# EAGLE design sumo_base_5 (EAGLE 6.3)
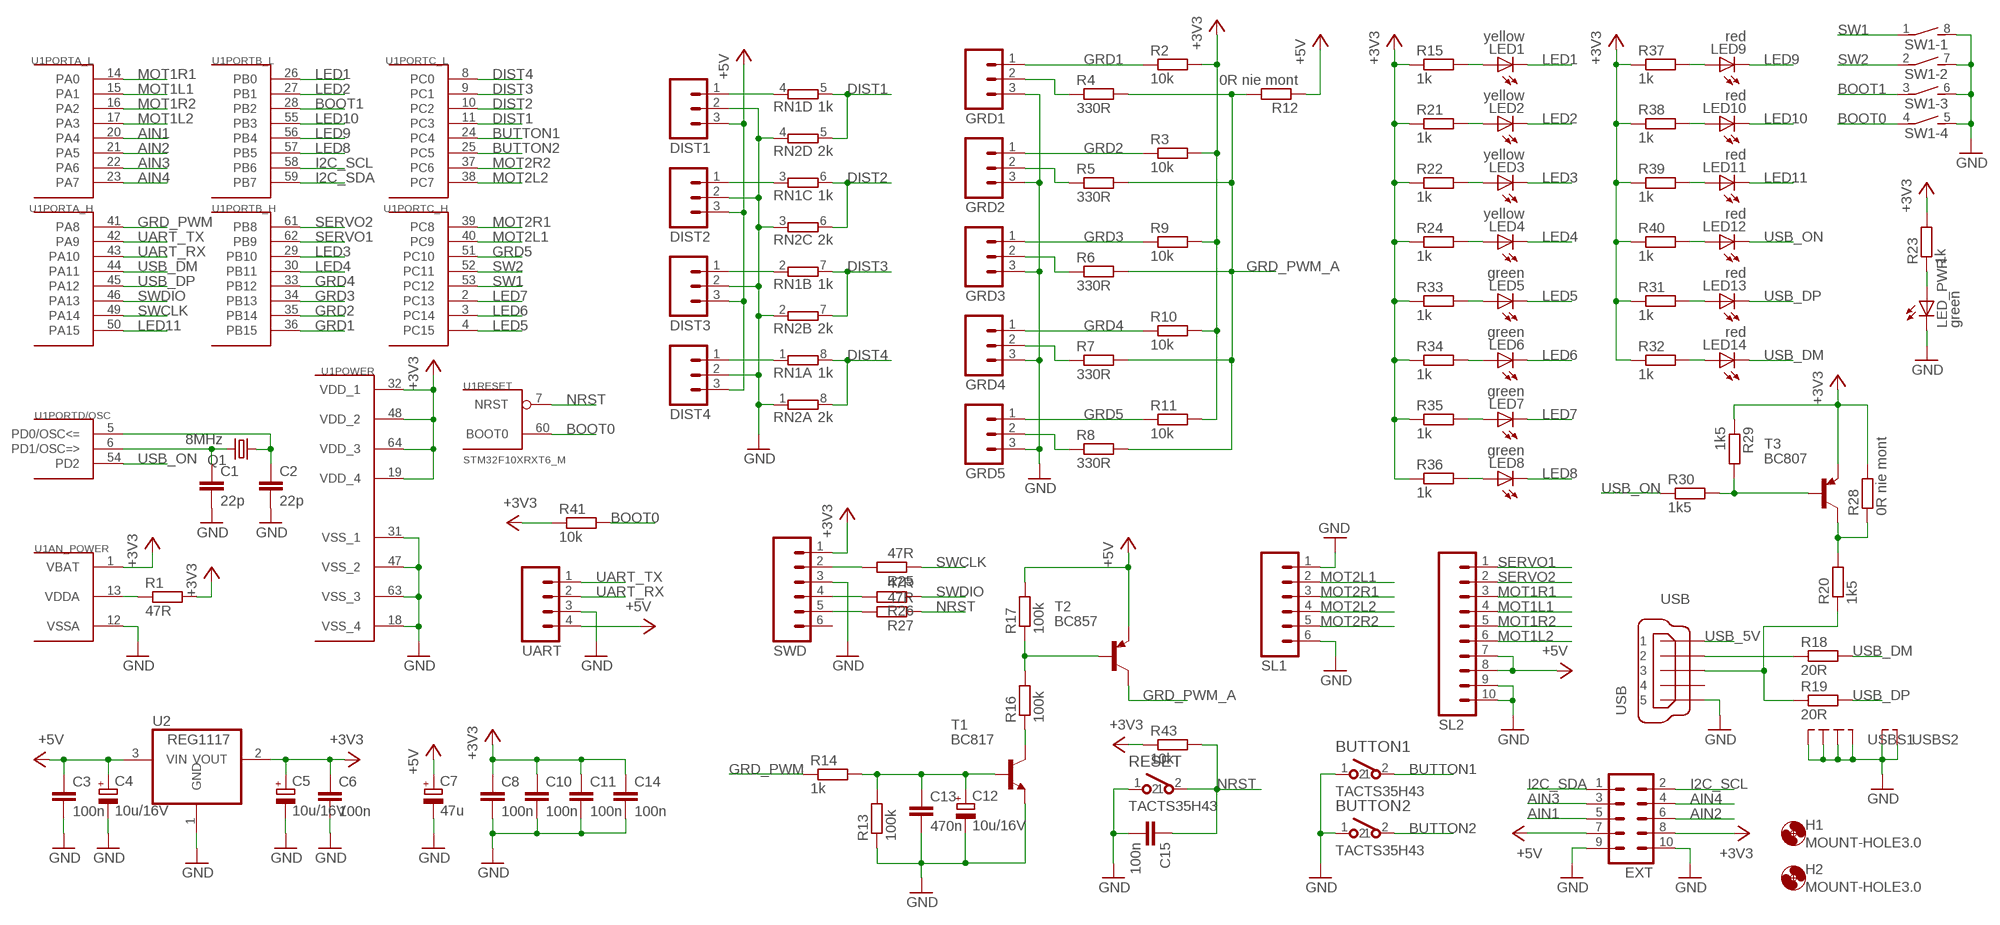
[diagram p0: schematic, sheet 1]

## Parts
BUTTON1  TACTS35H43  [TACTS35H43]
BUTTON2  TACTS35H43  [TACTS35H43]
C1  22p  C-EUC0603  [C0603]
C2  22p  C-EUC0603  [C0603]
C3  100n  C-EUC0603  [C0603]
C4  10u/16V  CPOL-EUSMCA  [SMC_A]
C5  10u/16V  CPOL-EUSMCA  [SMC_A]
C6  100n  C-EUC0603  [C0603]
C7  47u  CPOL-EUSMCB  [SMC_B]
C8  100n  C-EUC0603  [C0603]
C10  100n  C-EUC0603  [C0603]
C11  100n  C-EUC0603  [C0603]
C12  10u/16V  CPOL-EUSMCA  [SMC_A]
C13  470n  C-EUC0603  [C0603]
C14  100n  C-EUC0603  [C0603]
C15  100n  C-EUC0603  [C0603]
DIST1  M03  [03P]
DIST2  M03  [03P]
DIST3  M03  [03P]
DIST4  M03  [03P]
EXT  MA05-2  [MA05-2]
GRD1  M03  [03P]
GRD2  M03  [03P]
GRD3  M03  [03P]
GRD4  M03  [03P]
GRD5  M03  [03P]
H1  MOUNT-HOLE3.0  [3,0]
H2  MOUNT-HOLE3.0  [3,0]
LED1  yellow  LEDSML0805  [SML0805]
LED2  yellow  LEDSML0805  [SML0805]
LED3  yellow  LEDSML0805  [SML0805]
LED4  yellow  LEDSML0805  [SML0805]
LED5  green  LEDSML0805  [SML0805]
LED6  green  LEDSML0805  [SML0805]
LED7  green  LEDSML0805  [SML0805]
LED8  green  LEDSML0805  [SML0805]
LED9  red  LEDSML0805  [SML0805]
LED10  red  LEDSML0805  [SML0805]
LED11  red  LEDSML0805  [SML0805]
LED12  red  LEDSML0805  [SML0805]
LED13  red  LEDSML0805  [SML0805]
LED14  red  LEDSML0805  [SML0805]
LED_PWR  green  LEDSML0805  [SML0805]
Q1  8MHz  CRYSTALHC49S  [HC49/S]
R1  47R  R-EU_R0603  [R0603]
R2  10k  R-EU_R0603  [R0603]
R3  10k  R-EU_R0603  [R0603]
R4  330R  R-EU_R0603  [R0603]
R5  330R  R-EU_R0603  [R0603]
R6  330R  R-EU_R0603  [R0603]
R7  330R  R-EU_R0603  [R0603]
R8  330R  R-EU_R0603  [R0603]
R9  10k  R-EU_R0603  [R0603]
R10  10k  R-EU_R0603  [R0603]
R11  10k  R-EU_R0603  [R0603]
R12  0R nie mont  R-EU_R0603  [R0603]
R13  100k  R-EU_R0603  [R0603]
R14  1k  R-EU_R0603  [R0603]
R15  1k  R-EU_R0603  [R0603]
R16  100k  R-EU_R0603  [R0603]
R17  100k  R-EU_R0603  [R0603]
R18  20R  R-EU_R0603  [R0603]
R19  20R  R-EU_R0603  [R0603]
R20  1k5  R-EU_R0603  [R0603]
R21  1k  R-EU_R0603  [R0603]
R22  1k  R-EU_R0603  [R0603]
R23  1k  R-EU_R0603  [R0603]
R24  1k  R-EU_R0603  [R0603]
R25  47R  R-EU_R0603  [R0603]
R26  47R  R-EU_R0603  [R0603]
R27  47R  R-EU_R0603  [R0603]
R28  0R nie mont  R-EU_R0603  [R0603]
R29  1k5  R-EU_R0603  [R0603]
R30  1k5  R-EU_R0603  [R0603]
R31  1k  R-EU_R0603  [R0603]
R32  1k  R-EU_R0603  [R0603]
R33  1k  R-EU_R0603  [R0603]
R34  1k  R-EU_R0603  [R0603]
R35  1k  R-EU_R0603  [R0603]
R36  1k  R-EU_R0603  [R0603]
R37  1k  R-EU_R0603  [R0603]
R38  1k  R-EU_R0603  [R0603]
R39  1k  R-EU_R0603  [R0603]
R40  1k  R-EU_R0603  [R0603]
R41  10k  R-EU_R0603  [R0603]
R43  10k  R-EU_R0603  [R0603]
RESET  TACTS35H43  [TACTS35H43]
RN1  1k  CAT16XXXJ4CAT16  [CAT16XXX]
RN2  2k  CAT16XXXJ4CAT16  [CAT16XXX]
SL1  M06  [06P]
SL2  M10  [10P]
SW1  DIP04S  [DIP04S]
SWD  M06  [06P]
T1  BC817  BC817-NPN-SOT23-BEC  [SOT23-BEC]
T2  BC857  BC857C-PNP-SOT23-BEC  [SOT23-BEC]
T3  BC807  BC807-16-PNP-SOT23-BEC  [SOT23-BEC]
U1  STM32F10XRXT6_M  [FP64E]
U2  REG1117  [SOT223]
UART  M04  [04P]
USB  USB  MICRO-USB_5P4S  [MX47346]

## Nets
+3V3: C5.+ C6.1 C8.1 C10.1 C11.1 C14.1 EXT.8 R1.2 R2.2 R3.2 R9.2 R10.2 R11.2 R15.1 R21.1 R22.1 R23.2 R24.1 R28.2 R29.1 R31.1 R32.1 R33.1 R34.1 R35.1 R36.1 R37.1 R38.1 R39.1 R40.1 R41.1 R43.1 SWD.1 T3.E U1.1(AN_POWER:VBAT) U1.19(POWER:VDD_4) U1.32(POWER:VDD_1) U1.48(POWER:VDD_2) U1.64(POWER:VDD_3) U2.2(VOUT)
+5V: C3.1 C4.+ C7.+ DIST1.3 DIST2.3 DIST3.3 DIST4.3 EXT.7 R12.1 R17.2 SL2.7 SL2.8 T2.E U2.3(VIN) UART.4
AIN1: EXT.5 U1.20(PORTA_L:PA4)
AIN2: EXT.6 U1.21(PORTA_L:PA5)
AIN3: EXT.3 U1.22(PORTA_L:PA6)
AIN4: EXT.4 U1.23(PORTA_L:PA7)
BOOT0: R41.2 SW1.4 U1.60(RESET:BOOT0)
BOOT1: SW1.3 U1.28(PORTB_L:PB2)
BUTTON1: BUTTON1.2 U1.24(PORTC_L:PC4)
BUTTON2: BUTTON2.2 U1.25(PORTC_L:PC5)
DIST1: RN1.5 RN2.5 U1.11(PORTC_L:PC3)
DIST2: RN1.6 RN2.6 U1.10(PORTC_L:PC2)
DIST3: RN1.7 RN2.7 U1.9(PORTC_L:PC1)
DIST4: RN1.8 RN2.8 U1.8(PORTC_L:PC0)
GND: BUTTON1.1 BUTTON2.1 C1.2 C2.2 C3.2 C4.- C5.- C6.2 C7.- C8.2 C10.2 C11.2 C12.- C13.2 C14.2 C15.2 DIST1.2 DIST2.2 DIST3.2 DIST4.2 EXT.9 EXT.10 GRD1.3 GRD2.3 GRD3.3 GRD4.3 GRD5.3 LED_PWR.C R13.1 RESET.1 RN2.1 RN2.2 RN2.3 RN2.4 SL1.1 SL1.6 SL2.9 SL2.10 SW1.5 SW1.6 SW1.7 SW1.8 SWD.3 T1.E U1.12(AN_POWER:VSSA) U1.18(POWER:VSS_4) U1.31(POWER:VSS_1) U1.47(POWER:VSS_2) U1.63(POWER:VSS_3) U2.1(GND) UART.3 USB.5 USB.M1(S1) USB.M2(S2) USB.M3(S3) USB.M4(S4) USB.M5(S1) USB.M6(S2)
GRD1: GRD1.1 R2.1 U1.36(PORTB_H:PB15)
GRD2: GRD2.1 R3.1 U1.35(PORTB_H:PB14)
GRD3: GRD3.1 R9.1 U1.34(PORTB_H:PB13)
GRD4: GRD4.1 R10.1 U1.33(PORTB_H:PB12)
GRD5: GRD5.1 R11.1 U1.51(PORTC_H:PC10)
GRD_PWM: R14.1 U1.41(PORTA_H:PA8)
GRD_PWM_A: R4.2 R5.2 R6.2 R7.2 R8.2 R12.2 T2.C
I2C_SCL: EXT.2 U1.58(PORTB_L:PB6)
I2C_SDA: EXT.1 U1.59(PORTB_L:PB7)
LED1: LED1.C U1.26(PORTB_L:PB0)
LED2: LED2.C U1.27(PORTB_L:PB1)
LED3: LED3.C U1.29(PORTB_H:PB10)
LED4: LED4.C U1.30(PORTB_H:PB11)
LED5: LED5.C U1.4(PORTC_H:PC15)
LED6: LED6.C U1.3(PORTC_H:PC14)
LED7: LED7.C U1.2(PORTC_H:PC13)
LED8: LED8.C U1.57(PORTB_L:PB5)
LED9: LED9.C U1.56(PORTB_L:PB4)
LED10: LED10.C U1.55(PORTB_L:PB3)
LED11: LED11.C U1.50(PORTA_H:PA15)
MOT1L1: SL2.4 U1.15(PORTA_L:PA1)
MOT1L2: SL2.6 U1.17(PORTA_L:PA3)
MOT1R1: SL2.3 U1.14(PORTA_L:PA0)
MOT1R2: SL2.5 U1.16(PORTA_L:PA2)
MOT2L1: SL1.2 U1.40(PORTC_H:PC9)
MOT2L2: SL1.4 U1.38(PORTC_L:PC7)
MOT2R1: SL1.3 U1.39(PORTC_H:PC8)
MOT2R2: SL1.5 U1.37(PORTC_L:PC6)
N$1: R29.2 R30.2 T3.B
N$2: R20.2 R28.1 T3.C
N$3: LED_PWR.A R23.1
N$4: LED12.A R40.2
N$8: LED13.A R31.2
N$9: LED14.A R32.2
N$12: R25.2 SWD.2
N$49: C2.1 Q1.1 U1.5(PORTD/OSC:PD0/OSC<=)
N$50: C1.1 Q1.2 U1.6(PORTD/OSC:PD1/OSC=>)
N$52: R1.1 U1.13(AN_POWER:VDDA)
N$53: DIST1.1 RN1.4
N$54: GRD3.2 R6.1
N$55: DIST3.1 RN1.2
N$56: DIST2.1 RN1.3
N$57: DIST4.1 RN1.1
N$58: GRD1.2 R4.1
N$59: GRD2.2 R5.1
N$60: GRD4.2 R7.1
N$61: GRD5.2 R8.1
N$63: C12.+ C13.1 R13.2 R14.2 T1.B
N$64: LED1.A R15.2
N$65: LED2.A R21.2
N$66: LED3.A R22.2
N$67: LED4.A R24.2
N$68: LED5.A R33.2
N$69: LED6.A R34.2
N$70: LED7.A R35.2
N$71: LED8.A R36.2
N$72: R16.1 T1.C
N$73: R16.2 R17.1 T2.B
N$74: R18.1 USB.2
N$75: R19.1 R20.1 USB.3
N$80: LED9.A R37.2
N$81: LED10.A R38.2
N$82: LED11.A R39.2
N$90: R26.2 SWD.4
N$91: R27.2 SWD.5
NRST: C15.1 R27.1 R43.2 RESET.2 U1.7(RESET:NRST)
SERVO1: SL2.1 U1.62(PORTB_H:PB9)
SERVO2: SL2.2 U1.61(PORTB_H:PB8)
SW1: SW1.1 U1.53(PORTC_H:PC12)
SW2: SW1.2 U1.52(PORTC_H:PC11)
SWCLK: R25.1 U1.49(PORTA_H:PA14)
SWDIO: R26.1 U1.46(PORTA_H:PA13)
UART_RX: U1.43(PORTA_H:PA10) UART.2
UART_TX: U1.42(PORTA_H:PA9) UART.1
USB_5V: USB.1
USB_DM: LED14.C R18.2 U1.44(PORTA_H:PA11)
USB_DP: LED13.C R19.2 U1.45(PORTA_H:PA12)
USB_ON: LED12.C R30.1 U1.54(PORTD/OSC:PD2)
Unconnected: SWD.6 USB.4

## Library data of the parts
BUTTON1 BUTTON2 RESET = sw:TACTS35H43
C1-C3 C6 C8 C10 C11 C13-C15 = rcl:C-EU: CAPACITOR, European symbol
C4 C5 C7 C12 = rcl:CPOL-EU: POLARIZED CAPACITOR, European symbol
DIST1-DIST4 GRD1-GRD5 = con-amp-quick:M03: AMP QUICK CONNECTOR; OC_FARNELL: unknown; OC_NEWARK: unknown
EXT = con-lstb:MA05-2: PIN HEADER; OC_FARNELL: unknown; OC_NEWARK: unknown
H1 H2 = holes:MOUNT-HOLE: MOUNTING HOLE with drill center marker
LED1-LED14 LED_PWR = led:LED: LED OSRAM: - CHIPLED LG R971, LG N971, LY N971, LG Q971, LY Q971, LO R971, LY R971 LH N974, LH R974 LS Q976, LO Q976, LY Q976 LO Q996 - Hyper CHIPLED LW Q18S LB Q993, LB Q99A, LB R99A - SideLED LS A670, LO A670, LY A670, LG A670, LP A670 LB A673, LV A673, LT A673, LW A673 LH A674 LY A675 LS A676, LA A676, LO A676, LY A676, LW A676 LS A679, LY A679, LG A679 - Hyper Micro SIDELED® LS Y876, LA Y876, LO Y876, LY Y876 LT Y87S - SmartLED LW L88C, LW L88S LB L89C, LB L89S, LG L890 LS L89K, LO L89K, LY L89K LS L896, LA L896, LO L896, LY L896 - TOPLED LS T670, LO T670, LY T670, LG T670, LP T670 LSG T670, LSP T670, LSY T670, LOP T670, LYG T670 LG T671, LOG T671, LSG T671 LB T673, LV T673, LT T673, LW T673 LH T674 LS T676, LA T676, LO T676, LY T676, LB T676, LH T676, LSB T676, LW T676 LB T67C, LV T67C, LT T67C, LS T67K, LO T67K, LY T67K, LW E67C LS E67B, LA E67B, LO E67B, LY E67B, LB E67C, LV E67C, LT E67C LW T67C LS T679, LY T679, LG T679 LS T770, LO T770, LY T770, LG T770, LP T770 LB T773, LV T773, LT T773, LW T773 LH T774 LS E675, LA E675, LY E675, LS T675 LS T776, LA T776, LO T776, LY T776, LB T776 LHGB T686 LT T68C, LB T68C - Hyper Mini TOPLED® LB M676 - Mini TOPLED Santana® LG M470 LS M47K, LO M47K, LY M47K Source: http://www.osram.convergy.de LUXEON: - LUMILED® LXK2-PW12-R00, LXK2-PW12-S00, LXK2-PW14-U00, LXK2-PW14-V00 LXK2-PM12-R00, LXK2-PM12-S00, LXK2-PM14-U00 LXK2-PE12-Q00, LXK2-PE12-R00, LXK2-PE12-S00, LXK2-PE14-T00, LXK2-PE14-U00 LXK2-PB12-K00, LXK2-PB12-L00, LXK2-PB12-M00, LXK2-PB14-N00, LXK2-PB14-P00, LXK2-PB14-Q00 LXK2-PR12-L00, LXK2-PR12-M00, LXK2-PR14-Q00, LXK2-PR14-R00 LXK2-PD12-Q00, LXK2-PD12-R00, LXK2-PD12-S00 LXK2-PH12-R00, LXK2-PH12-S00 LXK2-PL12-P00, LXK2-PL12-Q00, LXK2-PL12-R00 Source: www.luxeon.com KINGBRIGHT: KA-3528ASYC Source: www.kingbright.com
Q1 = crystal:CRYSTAL: CRYSTAL; OC_FARNELL: 1667008; OC_NEWARK: unknown
R1-R41 R43 = rcl:R-EU_: RESISTOR, European symbol
RN1 RN2 = ff:CAT16XXXJ4
SL1 SWD = con-amp-quick:M06: AMP QUICK CONNECTOR; OC_FARNELL: unknown; OC_NEWARK: unknown
SL2 = con-amp-quick:M10: AMP QUICK CONNECTOR; OC_FARNELL: unknown; OC_NEWARK: unknown
SW1 = switch-dil:DIP04S: DIL/CODE SWITCH; OC_FARNELL: unknown; OC_NEWARK: unknown
T1 = transistor:*-NPN-: NPN Transistror BF959 corrected 2008.03.06
T2 T3 = transistor:*-PNP-: PNP Transistror
U1 = stm32_ff:STM32F10XRXT6: STM32F101/103 64pin LQFP
U2 = burr-brown:REG1117: 800mA and 1A Low Dropout (LDO) Positive Regulator 1.8V, 2.5V, 2.85V, 3.3V, 5V, and Adj; MPN: REG1117; OC_FARNELL: 1097566; OC_NEWARK: 14P6981
UART = con-amp-quick:M04: AMP QUICK CONNECTOR; OC_FARNELL: unknown; OC_NEWARK: unknown
USB = ff:MICRO-USB_5P4S

## Board
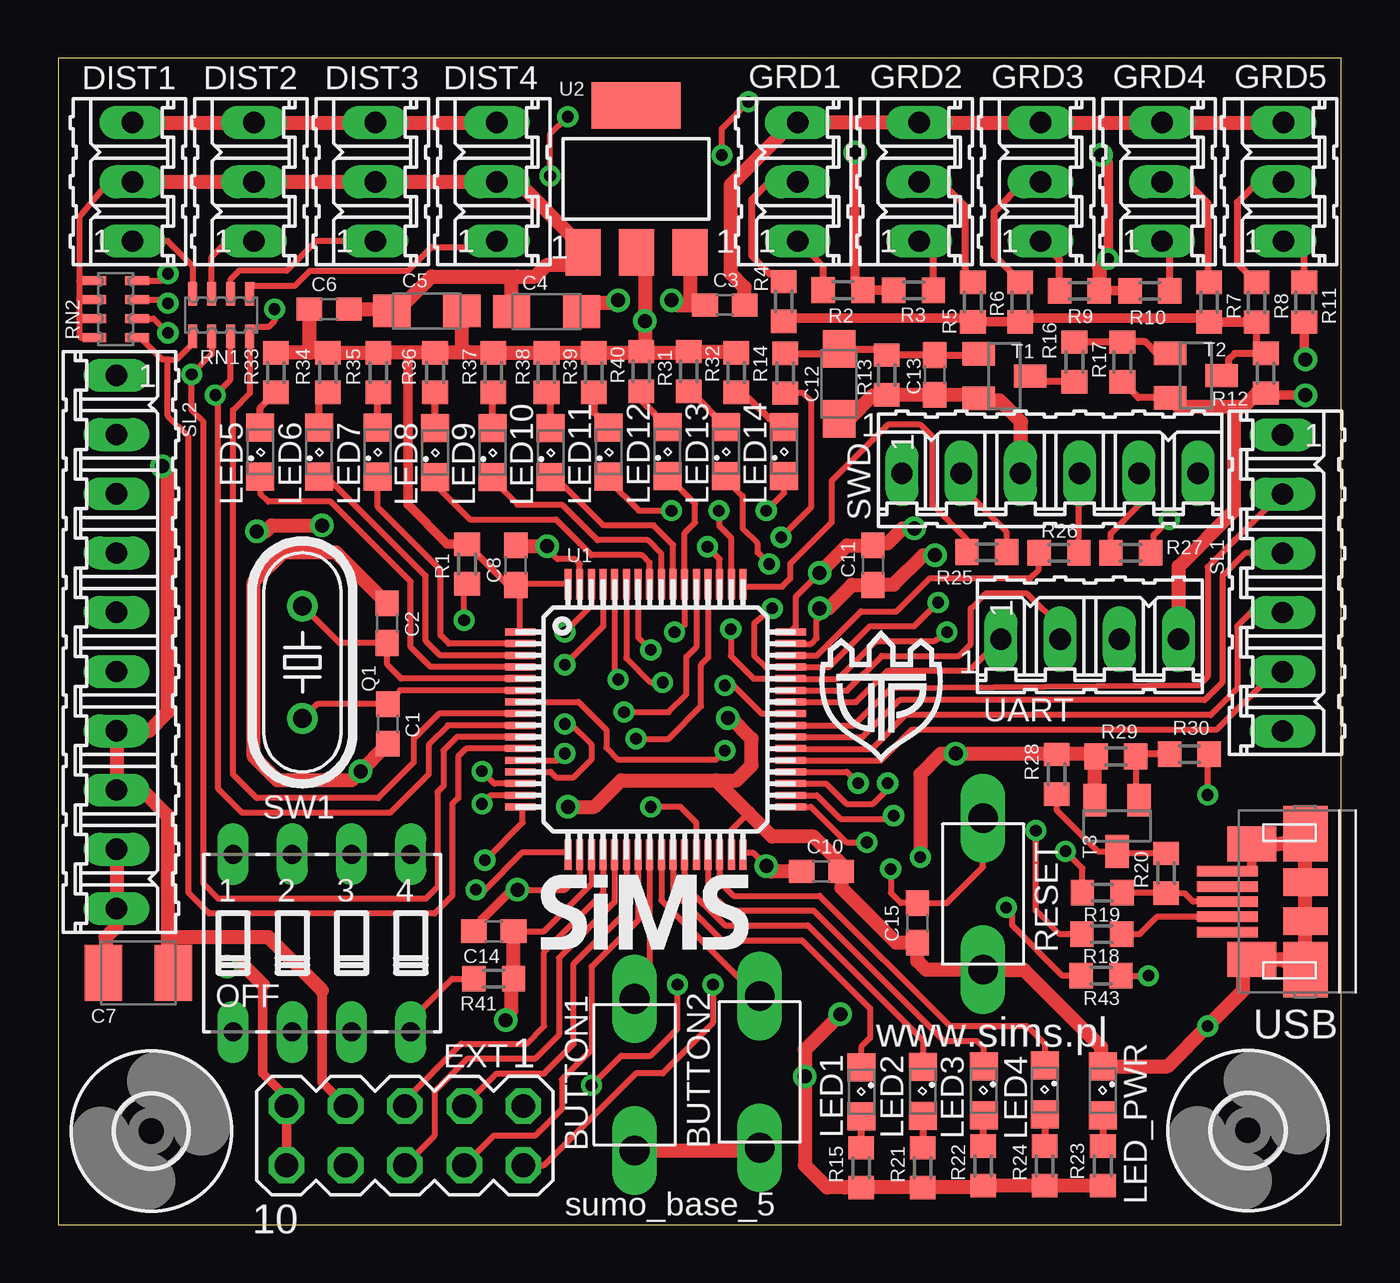
[diagram p1: board, top side]
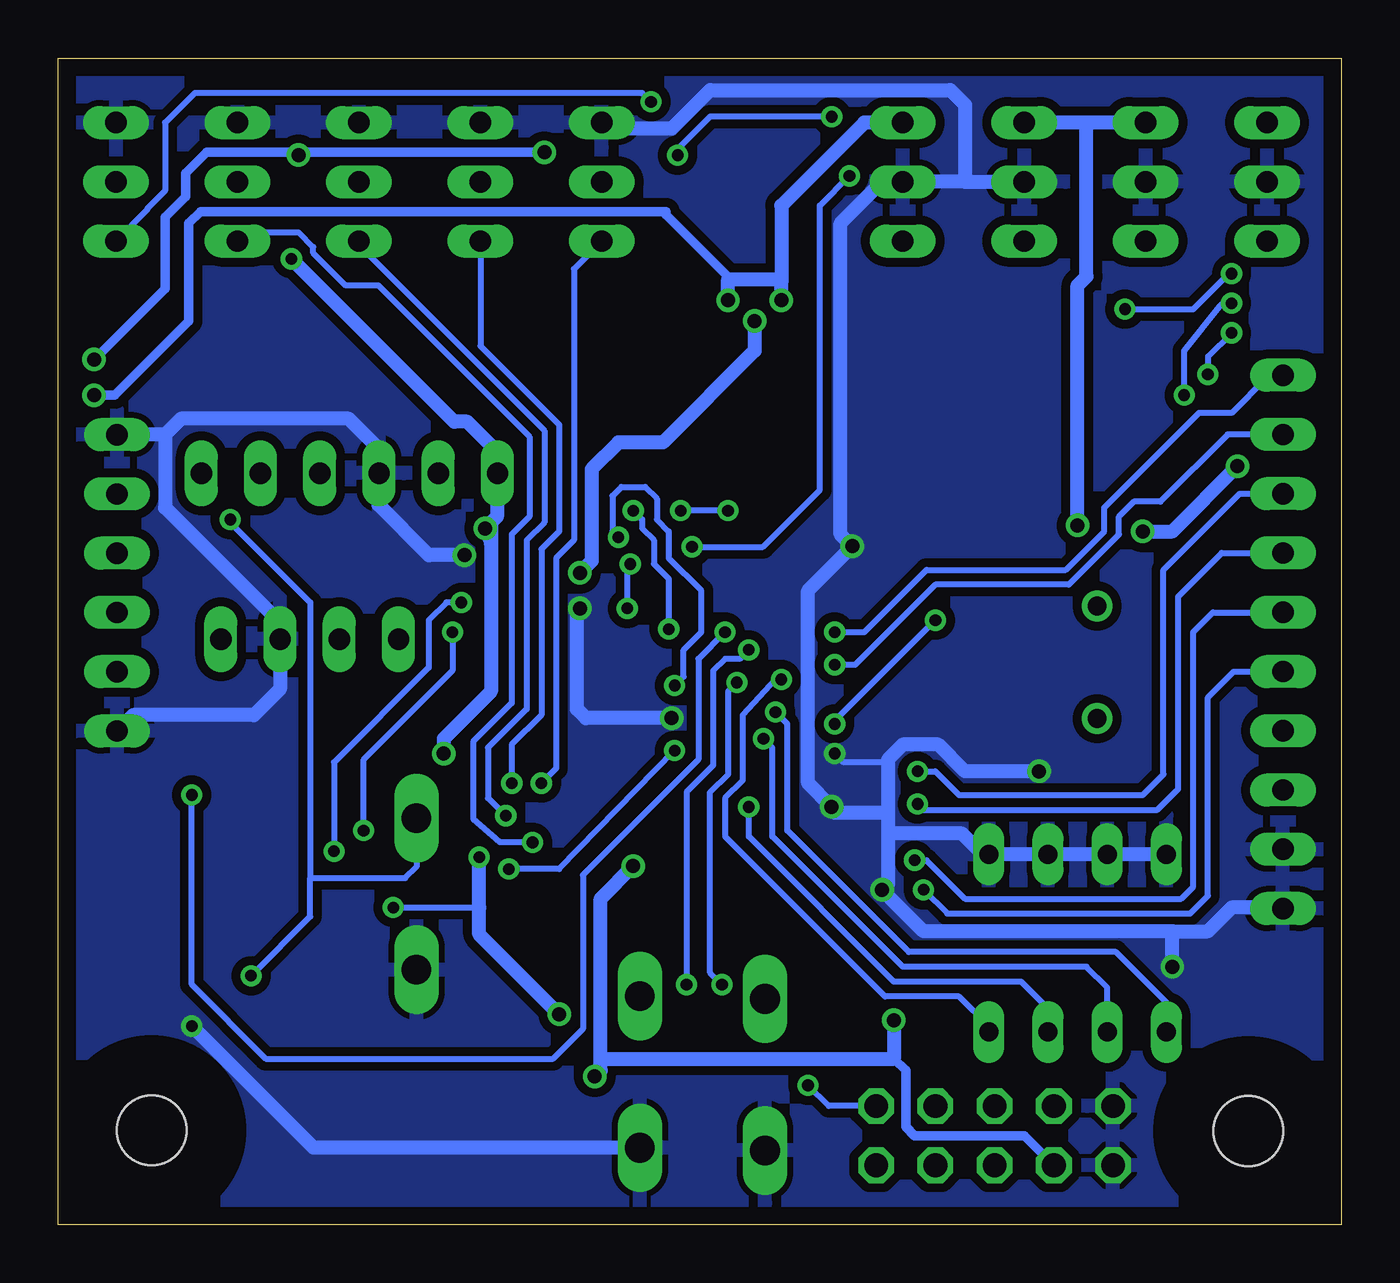
[diagram p2: board, bottom side, seen from below]

Size 55 x 50 mm. Coordinates in mm from the lower left corner, seen from the top.
Outline: 0,0 55,0 55,50 0,50 0,0
Copper layers (1*16): Top 0.035mm / dielectric 1.5mm / Bottom 0.035mm
Design rules "default *": minimum track width 10mil, minimum drill 19mil, track to track 15mil, track to pad 15mil, pad to pad 7mil, via to via 8mil, smd to smd 7mil, copper to edge 30mil, drill to drill 8mil, minimum pad ring 10mil, minimum via ring 8mil, stop-mask expansion 4mil, vias tented up to drill 100mil, thermal gap 10mil

### Footprints (pad centres in the part's own frame; a part is rotated, then mirrored left to right if it is on the bottom)
TACTS35H43 = drill 1.27 long: 1 -3.25,0; 2 3.25,0
C0603 = smd 1.1 x 1: 1 -0.85,0; 2 0.85,0
SMC_A = smd 1.6 x 1.4: + -1.5,0; - 1.5,0
SMC_B = smd 1.6 x 2.4: + -1.5,0; - 1.5,0
03P = drill 0.914 long: 1 -2.54,0; 2 0,0; 3 2.54,0
MA05-2 = drill 1.016 octagon: 1 -5.08,-1.27; 2 -5.08,1.27; 3 -2.54,-1.27; 4 -2.54,1.27; 5 0,-1.27; 6 0,1.27; 7 2.54,-1.27; 8 2.54,1.27; 9 5.08,-1.27; 10 5.08,1.27
3,0 = hole 3: 0,0
SML0805 = smd 1.2 x 1.2: A 1.05,0; C -1.05,0
HC49/S = drill 0.813: 1 -2.413,0; 2 2.413,0
R0603 = smd 1 x 1.1: 1 -0.85,0; 2 0.85,0
CAT16XXX = smd 0.381 x 1.016: 1 -1.219,-0.914; 2 -0.406,-0.914; 3 0.406,-0.914; 4 1.219,-0.914; 5 1.219,0.914; 6 0.406,0.914; 7 -0.406,0.914; 8 -1.219,0.914
06P = drill 0.914 long: 1 -6.35,0; 2 -3.81,0; 3 -1.27,0; 4 1.27,0; 5 3.81,0; 6 6.35,0
10P = drill 0.914 long: 1 -11.43,0; 2 -8.89,0; 3 -6.35,0; 4 -3.81,0; 5 -1.27,0; 6 1.27,0; 7 3.81,0; 8 6.35,0; 9 8.89,0; 10 11.43,0
DIP04S = drill 0.813 long: 1 -3.81,-3.81; 2 -1.27,-3.81; 3 1.27,-3.81; 4 3.81,-3.81; 5 3.81,3.81; 6 1.27,3.81; 7 -1.27,3.81; 8 -3.81,3.81
SOT23-BEC = smd 1 x 1.4: B -0.95,-1.1; C 0,1.1; E 0.95,-1.1
FP64E = smd 1.3 x 0.3: 1 -5.8,3.75; 2 -5.8,3.25; 3 -5.8,2.75; 4 -5.8,2.25; 5 -5.8,1.75; 6 -5.8,1.25; 7 -5.8,0.75; 8 -5.8,0.25; 9 -5.8,-0.25; 10 -5.8,-0.75; 11 -5.8,-1.25; 12 -5.8,-1.75; 13 -5.8,-2.25; 14 -5.8,-2.75; 15 -5.8,-3.25; 16 -5.8,-3.75; 33 5.8,-3.75; 34 5.8,-3.25; 35 5.8,-2.75; 36 5.8,-2.25; 37 5.8,-1.75; 38 5.8,-1.25; 39 5.8,-0.75; 40 5.8,-0.25; 41 5.8,0.25; 42 5.8,0.75; 43 5.8,1.25; 44 5.8,1.75; 45 5.8,2.25; 46 5.8,2.75; 47 5.8,3.25; 48 5.8,3.75 | smd 0.3 x 1.3: 17 -3.75,-5.8; 18 -3.25,-5.8; 19 -2.75,-5.8; 20 -2.25,-5.8; 21 -1.75,-5.8; 22 -1.25,-5.8; 23 -0.75,-5.8; 24 -0.25,-5.8; 25 0.25,-5.8; 26 0.75,-5.8; 27 1.25,-5.8; 28 1.75,-5.8; 29 2.25,-5.8; 30 2.75,-5.8; 31 3.25,-5.8; 32 3.75,-5.8; 49 3.75,5.8; 50 3.25,5.8; 51 2.75,5.8; 52 2.25,5.8; 53 1.75,5.8; 54 1.25,5.8; 55 0.75,5.8; 56 0.25,5.8; 57 -0.25,5.8; 58 -0.75,5.8; 59 -1.25,5.8; 60 -1.75,5.8; 61 -2.25,5.8; 62 -2.75,5.8; 63 -3.25,5.8; 64 -3.75,5.8
SOT223 = smd 1.499 x 2.007: 1 -2.261,-3.15; 2 0.025,-3.15; 3 2.311,-3.15 | smd 3.81 x 2.007: 4 0,3.15
04P = drill 0.914 long: 1 -3.81,0; 2 -1.27,0; 3 1.27,0; 4 3.81,0
MX47346 = smd 2.6 x 0.45: 1 3.35,1.3; 2 3.35,0.65; 3 3.35,0; 4 3.35,-0.65; 5 3.35,-1.3 | smd 1.9 x 2.375: M1 0,-2.913; M2 0,2.913 | smd 2.1 x 1.5: M3 2.3,2.475; M4 2.3,-2.475 | smd 1.9 x 1.175: M5 0,0.838; M6 0,-0.838

### Placement (x,y rotation side)
BUTTON1  24.7,6.43 90 top
BUTTON2  30.07,6.54 90 top
C1  14.12,21.46 270 top
C2  14.1,25.78 90 top
C3  28.57,39.42 0 top
C4  20.93,39.14 180 top
C5  15.8,39.17 180 top
C6  11.61,39.24 0 top
C7  3.43,10.79 180 top
C8  19.61,28.27 90 top
C10  32.72,15.14 0 top
C11  34.92,28.27 270 top
C12  33.48,36.04 270 top
C13  37.57,36.42 270 top
C14  18.67,12.57 180 top
C15  36.83,12.93 270 top
DIST1  3.17,44.7 90 top
DIST2  8.38,44.7 90 top
DIST3  13.59,44.7 90 top
DIST4  18.8,44.7 90 top
EXT  14.86,3.81 180 top
GRD1  31.7,44.7 90 top
GRD2  36.91,44.7 90 top
GRD3  42.11,44.7 90 top
GRD4  47.32,44.7 90 top
GRD5  52.53,44.7 90 top
H1  3.98,4 0 top
H2  51,4.04 0 top
LED1  34.44,5.69 270 top
LED2  37.06,5.71 270 top
LED3  39.67,5.74 270 top
LED4  42.29,5.77 270 top
LED5  8.66,33.12 90 top
LED6  11.18,33.12 90 top
LED7  13.69,33.12 90 top
LED8  16.15,33.1 90 top
LED9  18.62,33.1 90 top
LED10  21.11,33.1 90 top
LED11  23.6,33.12 90 top
LED12  26.11,33.15 90 top
LED13  28.63,33.15 90 top
LED14  31.11,33.15 90 top
LED_PWR  44.78,5.74 270 top
Q1  10.46,24.1 270 top
R1  17.53,28.32 90 top
R2  33.64,40.06 0 top
R3  36.67,40.04 180 top
R4  31.1,39.58 270 top
R5  39.21,39.55 270 top
R6  41.24,39.55 270 top
R7  49.33,39.54 270 top
R8  51.37,39.54 270 top
R9  43.78,40.03 0 top
R10  46.79,40.03 180 top
R11  53.42,39.54 270 top
R12  51.77,36.5 90 top
R13  35.51,36.42 90 top
R14  31.17,36.5 90 top
R15  34.42,2.44 90 top
R16  43.56,36.98 90 top
R17  45.62,36.98 270 top
R18  44.73,12.45 180 top
R19  44.75,14.22 180 top
R20  47.5,15.06 90 top
R21  37.06,2.44 90 top
R22  39.65,2.51 90 top
R23  44.78,2.51 270 top
R24  42.29,2.51 90 top
R25  39.8,28.83 0 top
R26  42.9,28.8 0 top
R27  45.97,28.8 180 top
R28  42.8,19.3 90 top
R29  45.34,20.07 0 top
R30  48.49,20.17 180 top
R31  27.03,36.58 270 top
R32  29.06,36.53 270 top
R33  9.32,36.53 270 top
R34  11.56,36.53 270 top
R35  13.72,36.53 270 top
R36  16.15,36.53 270 top
R37  18.64,36.53 270 top
R38  20.93,36.53 270 top
R39  22.96,36.53 270 top
R40  24.99,36.58 270 top
R41  18.67,10.54 180 top
R43  44.7,10.67 0 top
RESET  39.65,14.17 90 top
RN1  6.99,38.99 180 top
RN2  2.46,39.24 270 top
SL1  52.48,27.51 270 top
SL2  2.49,24.98 270 top
SW1  11.3,12.06 0 top
SWD  42.52,32.21 0 top
T1  40.56,36.37 270 top
T2  48.77,36.4 270 top
T3  45.39,17.09 180 top
U1  25.61,21.66 0 top
U2  24.77,44.83 0 top
U$1  [SIMS_035]  20.7,11.81 0 top
U$2  [UTP_011]  32.64,19.81 0 top
UART  44.22,25.1 0 top
USB  53.47,13.84 180 top

### Tracks (layer width: path | path; a pad name or v marks a point on that pad's centre or on a via)
+3V3  (via drill 0.5, 0.6)
  Top 0.254: 19.9,27.12 C8.1 | 19.68,27.34 C8.1 | v30.35,15.37 29.77,15.95 29.44,15.95 U1.32 | 31.38,25.41 31.62,25.65 31.62,26.92 v32.64,27.94 | U1.64 19.65,27.46 C8.1 | U1.1 19.81,27.22 C8.1 | 31.36,25.39 31.38,25.41 | 31.38,25.41 U1.48 | U1.19 22.86,14.6 20.83,12.57 C14.1 | R43.1 43.05,10.67 40.89,12.83 40.89,13.34 v40.64,13.59
  Top 0.305: C8.1 19.28,27.42 R1.2
  Top 0.406: 14.99,37.38 14.99,30.86 16.68,29.17 R1.2 | R10.2 R9.2 | v34.16,45.97 34.16,40.39 R2.2 35.8,40.06 R3.2 | R11.2 53.42,37.26 53.47,37.21 v53.47,37.08 | v44.7,45.85 45.01,45.54 v45.01,41.4
  Top 0.61: R23.2 R24.1 R22.1 39.98,1.59 R21.1 R15.1 | 17.4,37.38 R37.1 R38.1 R39.1 24.94,37.38 R40.1 25.09,37.43 25.15,37.38 | 17.4,37.38 R36.1 14.99,37.38 R35.1 R34.1 | R34.1 10.79,37.38 | 10.79,37.38 R33.1 | U2.2 24.79,41.12 25.15,40.77 v25.15,38.73 25.15,37.38 | C6.1 10.76,37.47 | 10.76,37.47 10.79,37.38 | 10.76,37.47 11.47,37.47 R34.1 | C5.+ 17.3,37.4 17.4,37.38 | 25.15,37.38 26.98,37.38 R31.1 29.01,37.43 R32.1 | C10.1 30.58,15.14 v30.35,15.37 | R15.1 33.72,1.59 | v36.96,15.75 36.96,19.3 37.85,20.19 v38.48,20.19 42.67,20.19 | v45.01,41.4 44.63,41.02 R9.2 | v32.64,27.94 33.82,29.12 C11.1 35.02,29.21 35.56,29.21 36.2,29.84 v36.7,29.84 | 42.67,20.19 44.49,20.19 R29.1 44.44,20.07 T3.E 44.44,18.12 | R28.2 42.71,20.15 42.67,20.19 | v19.18,8.76 19.18,8.89 19.43,9.14 19.43,10.45 R41.1 C14.1 | v33.53,9.02 32,7.49 v32,6.35 32,2.54 32.96,1.59 R15.1
  Bottom 0.254: v40.64,13.59 36.96,13.59
  Bottom 0.406: v44.7,45.85 44.58,45.97 | 44.58,45.97 v34.16,45.97 | 44.58,45.97 48.64,45.97 49.53,45.09 49.53,44.07 50.42,43.18 50.42,40.13 v53.47,37.08 | EXT.8 13.59,3.81 18.29,3.81 18.67,4.19 18.67,6.6 19.18,7.11
  Bottom 0.61: v19.18,8.76 19.18,7.11 31.62,7.11 31.75,6.99 | v30.35,15.37 31.75,13.97 31.75,6.99 | v32,6.35 31.75,6.6 31.75,6.99 | 36.45,29.21 36.45,30.1 36.2,30.35 36.2,32.18 SWD.1 36.17,33.12 37.47,34.42 38.02,34.42 v45.01,41.4 44.96,41.33 | 36.45,29.21 36.45,22.86 38.48,20.83 v38.48,20.19 | v25.15,38.73 25.15,37.47 29.08,33.53 30.99,33.53 32.13,32.38 32.13,28.45 v32.64,27.94 | v36.7,29.84 36.45,29.21 | v33.53,9.02 36.96,12.45 36.96,13.59 v36.96,15.75
+5V  (via drill 0.6)
  Top 0.305: T2.E 46.3,35.45 R17.2 45.56,35.94 45.97,35.94
  Top 0.406: EXT.7 11.3,6.1 11.3,10.03 | 5.44,10.29 C7.+ | R12.1 51.85,35.56 v53.47,35.56 | 27.43,42.04 U2.3
  Top 0.61: 4.7,12.32 4.7,17.53 3.6,18.63 SL2.8 SL2.7 3.9,21.17 4.7,21.97 4.7,32.26 v4.45,32.51 | 4.7,12.32 4.7,10.64 C7.+ | C4.+ 22.45,39.27 | DIST1.3 DIST2.3 DIST3.3 DIST4.3 | U2.3 27.08,39.52 27.18,39.42 C3.1 26.49,39.42 v26.29,39.62 | 22.53,39.24 C4.+ | R12.1 51.4,35.65 50.8,35.05 50.42,35.05 | 50.42,35.05 48.06,35.05 T2.E | v8.51,29.72 8.89,29.72 9.14,29.97 v11.3,29.97 | UART.4 48.03,28.22 50.42,30.61 50.42,35.05 | 11.3,10.03 9.02,12.32 4.7,12.32 | v24,39.62 23.88,39.5 22.86,39.5 22.5,39.14 C4.+
  Bottom 0.406: v53.47,35.56 52.58,35.56 49.4,38.73 49.4,42.93 48.9,43.43 28.96,43.43 28.96,43.31 26.29,40.64 26.29,40.51
  Bottom 0.61: DIST4.3 20.45,47.24 24,43.69 24,40.39 | v4.45,32.51 7.24,29.72 v8.51,29.72 | v11.3,29.97 11.3,40.26 10.92,40.64 10.92,47.12 11.05,47.24 DIST3.3 | DIST2.3 10.92,47.24 | v24,39.62 24,40.39 | 24,40.39 24.13,40.51 26.29,40.51 v26.29,39.62
AIN1
  Top 0.254: EXT.5 14.86,5.33 17.27,7.75 20.07,7.75 20.83,8.51 20.83,11.68 23.36,14.21 U1.20
AIN2
  Top 0.254: EXT.6 16.13,3.81 16.13,5.71 17.53,7.11 20.45,7.11 21.46,8.13 21.46,11.43 23.86,13.82 U1.21
AIN3
  Top 0.254: EXT.3 18.8,6.48 20.83,6.48 22.1,7.75 22.1,11.18 24.36,13.44 U1.22
AIN4
  Top 0.254: EXT.4 18.67,3.81 20.45,3.81 21.59,4.95 21.59,6.22 22.86,7.49 22.86,11.05 24.86,13.05 U1.23
BOOT0  (via drill 0.5)
  Top 0.254: 23.85,23.52 v24,23.37 23.86,23.51 U1.60 | SW1.4 15.11,8.76 16.89,10.54 R41.2
  Bottom 0.254: SW1.4 15.11,8.51 16.38,9.78 19.56,9.78 26.42,16.64 26.42,18.29 25.65,19.05 25.65,21.84 24.26,23.37 v24,23.37
BOOT1  (via drill 0.5)
  Top 0.254: v25.4,17.91 26.67,17.91 27.36,17.22 U1.28
  Bottom 0.254: SW1.3 12.57,9.27 13.72,10.41 19.18,10.41 25.4,16.64 v25.4,17.91
BUTTON1
  Top 0.254: BUTTON1.2 25.36,10.33 U1.24
BUTTON2
  Top 0.254: BUTTON2.2 29.57,10.29 29.46,10.29 25.85,13.9 25.86,13.9 U1.25
DIST1
  Top 0.254: U1.11 17.49,20.41 17.14,20.07 17.14,18.29 16.89,18.03 16.89,14.1 16.13,13.34 6.48,13.34 5.59,14.22 5.59,33.78 4.7,34.67 4.7,37.08 | RN1.5 5.73,38.04 5.73,37.74 5.08,37.08 4.7,37.08 | 3.36,38.04 RN2.5 3.5,38.02 4.45,37.08 4.7,37.08
DIST2  (via drill 0.5)
  Top 0.254: U1.10 17.1,20.91 16.51,20.32 16.51,18.8 16.26,18.54 16.26,14.48 15.75,13.97 6.86,13.97 6.22,14.61 6.22,34.42 5.71,34.92 v5.71,36.45 6.58,37.31 RN1.6 | v4.7,38.23 4.08,38.84 RN2.6
  Bottom 0.254: v4.7,38.23 5.71,37.21 v5.71,36.45
DIST3  (via drill 0.5)
  Top 0.254: U1.9 16.71,21.41 15.88,20.57 15.88,19.3 14.22,17.65 7.87,17.65 6.86,18.67 6.86,35.43 v6.73,35.56 7.37,36.2 7.37,38.05 RN1.7 | RN2.7 4.55,39.65 v4.7,39.5
  Bottom 0.254: v6.73,35.56 6.73,37.47 5.21,39.37 5.08,39.5 v4.7,39.5
DIST4  (via drill 0.5)
  Top 0.254: U1.8 16.32,21.91 15.24,20.83 15.24,19.81 13.72,18.29 8.51,18.29 7.49,19.3 7.49,34.92 8.2,35.64 RN1.8 | 8.2,38.05 RN1.8 | v9.27,39.24 9.27,38.73 9.02,38.48 8.51,38.48 8.2,38.18 RN1.8 | RN2.8 4.39,40.46 v4.7,40.77
  Bottom 0.254: v4.7,40.77 4.95,40.64 6.35,39.24 v9.27,39.24
GND  (via drill 0.5, 0.6)
  Top 0.254: DIST1.2 2.16,44.7 0.89,43.18 0.89,40.46 | v20.95,29.08 20.95,28.96 21.41,28.52 22.15,28.52 22.36,28.32 U1.63 | 21.38,19.89 v21.72,20.19 | 29.59,17.65 28.85,16.92 28.86,16.91 U1.31 | v32.64,26.42 32.64,26.04 32.51,25.91 32.51,25.15 32.26,24.89 31.42,24.89 U1.47 | C7.- 1.93,10.77 2.03,10.67 | 21.43,19.91 v21.72,20.19 | U1.18 22.36,14.99 21.72,14.35 v19.68,14.35 | U1.12 21.43,19.91 | 21.43,19.91 v21.72,20.19 | 34.92,27.43 C11.2 | 1.61,39.71 RN2.2 0.89,39.65 | 0.89,40.46 0.89,39.65 | 0.89,39.65 0.89,38.84 | 0.89,38.84 0.89,38.1 0.96,38.02 RN2.4 | RN2.3 0.89,38.84 | RN2.1 0.89,40.46
  Top 0.305: C12.- 33.15,34.54
  Top 0.406: EXT.10 EXT.9 9.78,5.46 8.76,6.48 8.76,10.29 | USB.5 51.17,15.14 USB.M4 | v19.68,14.35 19.43,14.35 18.16,13.08 18.16,12.91 C14.2
  Top 0.61: SL2.9 SL2.10 2.49,12.78 2.03,12.32 2.03,10.67 2.03,10.52 | BUTTON1.1 29.95,3.18 BUTTON2.1 | v7.24,11.05 8,11.05 8.76,10.29 | GRD5.3 GRD4.3 GRD3.3 GRD2.3 GRD1.3 31.5,47.24 28.83,44.58 28.83,40.77 29.43,40.17 C3.2 | 19.68,40.64 16,40.64 14.53,39.17 C5.- 14.35,39.24 C6.2 | 19.68,40.64 20.45,40.64 20.95,41.15 21.97,41.15 U2.1 22.23,41.96 22.23,42.16 19.68,44.7 DIST4.2 DIST3.2 DIST2.2 DIST1.2 | C4.- 19.43,40.51 19.68,40.64 | C8.2 19.65,29.08 v20.95,29.08 | C1.2 14.12,20.47 13.99,20.47 v12.95,19.43 12.57,19.05 9.4,19.05 8.38,20.07 8.38,27.56 9.65,28.83 11.9,28.83 C2.2 | v21.84,17.91 22.99,17.91 24.13,19.05 28.19,19.05 | 28.19,19.05 29.59,17.65 30.61,16.64 32.38,16.64 33.56,15.46 C10.2 33.56,14.44 35.93,12.08 C15.2 36.83,11.3 37.21,10.92 RESET.1 41.4,10.92 44.7,7.62 44.7,6.87 LED_PWR.C 47.56,6.79 v49.28,8.51 50.8,10.03 50.8,11.1 USB.M3 52.4,11.37 USB.M2 USB.M5 USB.M6 USB.M1 52.4,16.32 USB.M4 | 41.25,34.44 40.35,35.34 39.46,35.34 T1.E 39.31,35.57 C13.2 R13.1 35.5,35.56 34.92,35.56 33.91,34.54 C12.- | 41.27,34.42 41.25,34.44 | 28.19,19.05 29.08,19.05 29.72,19.68 29.72,20.83 28.83,21.72 v28.7,21.72 | v32.64,26.42 33.02,26.42 34.02,27.42 C11.2 | 34.92,27.43 35.81,27.43 37.08,28.7 v37.59,28.7 | 41.25,34.44 SWD.3
  Bottom 0.254: 19.43,19.94 19.56,19.81 21.34,19.81 v21.72,20.19
  Bottom 0.61: SW1.8 SW1.7 SW1.6 SW1.5 15.37,15.88 16.26,16.76 19.43,16.76 | 19.43,17.65 19.43,19.94 18.8,20.57 17.27,20.57 16.13,19.43 v12.95,19.43 | 19.43,17.65 19.43,16.76 | 19.43,16.76 19.43,14.61 v19.68,14.35 17.91,12.57 7.24,12.57 | SL2.10 2.53,13.59 4.7,13.59 5.71,12.57 7.24,12.57 | v7.24,11.05 7.24,12.57 | 16.13,44.7 DIST3.2 | 19.43,17.65 21.72,17.65 v21.84,17.91 22.86,18.92 22.86,27.18 v20.95,29.08 21.46,29.59 21.46,42.93 19.75,44.64 18.86,44.64 DIST4.2 16.13,44.7 | GRD1.3 31.45,46.99 28.7,46.99 27.05,48.64 16.76,48.64 16.13,48.01 16.13,44.7 | BUTTON2.1 44.06,3.29 v49.28,8.51 | 50.42,33.86 50.42,30.73 45.47,25.78 45.47,25.12 UART.3 45.49,22.96 46.61,21.84 51.8,21.84 SL1.6 | v28.7,21.72 32.38,21.72 32.77,22.1 32.77,26.29 v32.64,26.42 | v37.59,28.7 39.12,28.7 41.27,30.86 41.27,33.27 42.55,34.54 49.73,34.54 50.42,33.86 | 50.42,33.86 SL1.1
  pour Bottom: 0.38,0.38 54.61,0.38 54.61,49.66 0.38,49.66
GRD1  (via drill 0.5)
  Top 0.254: 32.79,41.07 GRD1.1 | 33.82,19.39 v34.29,18.92 33.81,19.41 U1.36
  Top 0.305: R2.1 32.79,41.07
  Bottom 0.254: GRD1.1 32.89,40.97 32.89,29.34 33.66,28.57 33.66,19.56 v34.29,18.92
GRD2  (via drill 0.5)
  Top 0.254: 37.52,41.55 GRD2.1 | v35.56,18.92 35.56,18.67 34.92,18.03 33.78,18.03 32.91,18.91 U1.35
  Top 0.305: R3.1 37.52,41.55
  Bottom 0.254: GRD2.1 36.91,37.67 33.53,34.29 33.53,29.72 34.29,28.96 34.29,21.84 35.56,20.57 v35.56,18.92
GRD3  (via drill 0.5)
  Top 0.254: 42.93,41.35 GRD3.1 | v35.81,17.53 35.69,17.4 33.53,17.4 32.52,18.41 U1.34
  Top 0.305: R9.1 42.93,41.35
  Bottom 0.254: v35.81,17.53 36.58,18.29 36.58,20.45 34.92,22.1 34.92,29.34 34.16,30.1 34.16,34.04 42.11,41.99 GRD3.1
GRD4  (via drill 0.5)
  Top 0.254: 47.64,41.84 GRD4.1 | v34.67,16.38 33.78,16.38 32.26,17.91 U1.33
  Top 0.305: R10.1 47.64,41.84
  Bottom 0.254: v34.67,16.38 36.07,16.38 37.21,17.4 37.21,20.7 35.56,22.35 35.56,29.59 34.8,30.35 34.8,33.78 41.27,40.26 42.67,40.26 44.07,41.66 44.07,41.91 44.7,42.55 46.86,42.55 47.24,42.16 GRD4.1
GRD5  (via drill 0.5)
  Top 0.254: U1.51 28.36,28.53 v27.83,29.05 | v21.08,44.96 21.08,46.74 v21.84,47.5 | v28.45,45.85 28.45,46.99 v29.59,48.13
  Top 0.305: R11.1 53.42,41.83 53.09,42.16 GRD5.1
  Bottom 0.254: v27.83,29.05 24.79,29.05 22.35,31.5 22.35,43.69 v21.08,44.96 | v21.84,47.5 27.05,47.5 28.45,46.1 v28.45,45.85 | v29.59,48.13 29.97,48.51 49.15,48.51 50.42,47.24 50.42,44.32 51.18,43.56 51.18,43.51 GRD5.1
GRD_PWM  (via drill 0.5)
  Top 0.254: v28.57,23.11 28.96,23.11 30.18,21.89 31.39,21.89 U1.41 | R14.1 31.91,35.65 32.26,35.31 32.26,30.73 v30.99,29.46
  Bottom 0.254: v28.57,23.11 28.19,23.5 28.19,24.64 27.43,25.4 27.43,27.18 28.83,28.57 28.83,29.72 29.34,30.23 29.34,31.11 29.84,31.62 30.86,31.62 31.24,31.24 31.24,29.72 v30.99,29.46
GRD_PWM_A
  Top 0.305: R8.2 51.37,37.49 R12.2 50.43,37.35 50.16,37.08 50.16,36.7 T2.C
  Top 0.406: R8.2 R7.2 49.16,38.86 41.4,38.86 R6.2 R5.2 39.04,38.86 31.24,38.86 R4.2
I2C_SCL  (via drill 0.5)
  Top 0.254: v25.4,24.64 24.85,25.18 24.86,25.19 U1.58 | v28.07,10.29 28.07,8.64 25.91,6.48 24.77,6.48 20.83,2.54 EXT.2
  Bottom 0.254: v25.4,24.64 25.78,24.26 26.42,24.26 26.92,23.75 26.92,19.68 28.07,18.54 v28.07,10.29
I2C_SDA  (via drill 0.5)
  Top 0.254: v25.91,23.24 25.4,23.24 24.35,24.29 24.36,24.29 U1.59 | v26.54,10.29 26.54,8.38 25.4,7.24 24.13,7.24 v22.86,5.97
  Bottom 0.254: v25.91,23.24 26.29,22.86 26.29,19.3 27.05,18.54 27.05,10.79 v26.54,10.29 | EXT.1 21.97,5.08 v22.86,5.97
LED1
  Top 0.254: U1.26 26.36,14.29 26.35,14.29 28.45,12.19 31.88,12.19 34.8,9.27 34.8,8 34.44,7.64 LED1.C
LED2
  Top 0.254: U1.27 26.86,14.55 26.85,14.55 28.57,12.83 32.13,12.83 37.06,7.9 LED2.C
LED3
  Top 0.254: 40.06,6.81 LED3.C 39.67,7.57 39.37,7.87 37.97,7.87 32.38,13.46 28.7,13.46 27.85,14.31 27.86,14.31 U1.29
LED4
  Top 0.254: 42.59,6.82 LED4.C 42.29,7.75 41.53,8.51 38.23,8.51 32.64,14.1 28.96,14.1 28.35,14.7 28.36,14.7 U1.30
LED5
  Top 0.254: U1.4 15.97,23.91 15.11,24.77 15.11,27.56 11.68,30.99 9.02,30.99 8.66,31.34 LED5.C
LED6
  Top 0.254: 11.18,31.62 LED6.C 11.37,31.88 11.68,31.88 15.75,27.81 15.75,25.02 16.36,24.41 U1.3
LED7
  Top 0.254: LED7.C 13.69,30.76 16.38,28.07 16.38,25.27 16.75,24.91 U1.2
LED8
  Top 0.254: LED8.C 16.15,31.73 17.65,30.23 21.34,30.23 22.86,28.7 25.02,28.7 25.36,28.36 U1.57
LED9
  Top 0.254: LED9.C 18.62,31.93 19.68,30.86 21.59,30.86 23.11,29.34 25.27,29.34 25.86,28.75 U1.56
LED10
  Top 0.254: LED10.C 21.29,32.05 23.37,29.97 25.53,29.97 26.36,29.14 U1.55
LED11  (via drill 0.5)
  Top 0.254: LED11.C 23.6,31.9 24.89,30.61 v26.29,30.61 | v28.32,30.61 28.35,29.95 28.86,29.44 U1.50
  Bottom 0.254: v26.29,30.61 v28.32,30.61
MOT1L1  (via drill 0.5)
  Top 0.254: v18.16,18.03 18.53,18.41 U1.15
  Bottom 0.254: v18.16,18.03 17.91,17.78 7.87,17.78 6.99,18.67 6.99,26.92 5.12,28.79 SL2.4
MOT1L2  (via drill 0.5)
  Top 0.254: v17.91,14.35 18.29,14.35 19.88,15.95 21.77,15.95 U1.17
  Bottom 0.254: v17.91,14.35 16.89,13.34 6.48,13.34 5.71,14.1 5.71,22.61 4.61,23.71 SL2.6
MOT1R1  (via drill 0.5)
  Top 0.254: v18.16,19.43 18.7,18.89 18.71,18.91 U1.14
  Bottom 0.254: v18.16,19.43 17.4,19.43 16.38,18.41 8.51,18.41 7.62,19.3 7.62,28.07 4.36,31.33 SL2.3
MOT1R2  (via drill 0.5)
  Top 0.254: v18.29,15.62 19.9,17.24 19.9,17.81 U1.16
  Bottom 0.254: v18.29,15.62 17.78,15.62 16.13,13.97 6.86,13.97 6.35,14.48 6.35,25.4 5.5,26.25 SL2.5
MOT2L1
  Top 0.254: SL1.2 52.4,31.32 49.28,28.19 49.28,23.5 48.9,23.11 35.69,22.99 34.09,21.39 31.42,21.39 U1.40
MOT2L2
  Top 0.254: SL1.4 51.13,26.24 50.55,25.65 50.55,22.99 49.4,21.84 36.32,21.84 34.87,20.39 31.42,20.39 U1.38
MOT2R1
  Top 0.254: U1.39 31.42,20.89 34.48,20.89 36.07,22.48 49.15,22.48 49.91,23.24 49.91,27.81 50.88,28.78 SL1.3
MOT2R2
  Top 0.254: SL1.5 52.15,23.7 49.66,21.21 36.58,21.21 35.26,19.89 31.42,19.89 U1.37
N$1
  Top 0.254: T3.B 46.19,18.34 R29.2 46.29,20.17
  Top 0.305: R30.2 46.29,20.17
N$2
  Top 0.254: R20.2 45.47,15.91 T3.C 45.38,16 44.58,16 42.8,17.78 R28.1
N$3
  Top 0.305: LED_PWR.A R23.1
N$4
  Top 0.305: R40.2 24.99,35.31 LED12.A
N$8
  Top 0.305: R31.2 27.1,35.73 LED13.A
N$9
  Top 0.305: R32.2 29.35,35.67 30.48,34.54 30.77,34.54 LED14.A
N$12
  Top 0.254: SWD.2 38.71,31.65 40.64,29.72 40.64,28.84 R25.2
N$49
  Top 0.254: Q1.1 12.05,24.93 C2.1 14.1,24 14.69,23.41 U1.5
N$50
  Top 0.254: 14.22,21.91 C1.1 | C1.1 14.12,22.38 14.65,22.91 U1.6 | C1.1 11.09,22.31 Q1.2
N$52  (via drill 0.5)
  Top 0.254: v17.4,25.91 17.4,27.34 R1.1 | 21.11,19.41 21.34,19.18 22.1,19.18 22.86,19.94 22.86,20.57 21.97,21.46 v21.72,21.46 | U1.13 21.11,19.41 | 21.11,19.41
  Bottom 0.254: v17.4,25.91 21.72,21.59 v21.72,21.46
N$53
  Top 0.254: DIST1.1 4.7,42.16 5.77,41.1 RN1.4
N$54
  Top 0.305: R6.1 41.24,40.42 40.13,41.53 40.13,43.43 41.4,44.7 GRD3.2
N$55
  Top 0.254: DIST3.1 11.05,42.16 9.78,40.89 7.75,40.89 7.39,40.54 RN1.2
N$56
  Top 0.254: RN1.3 6.58,41.5 7.11,42.04 8.26,42.04 DIST2.1
N$57
  Top 0.254: DIST4.1 18.16,41.91 16,41.91 14.99,40.89 10.79,40.89 10.16,40.26 8.38,40.26 8.26,40.13 8.26,39.95 RN1.1
N$58
  Top 0.305: GRD1.2 30.48,44.7 29.72,43.94 29.72,41.53 30.48,40.77 30.76,40.77 R4.1 30.95,40.42
N$59
  Top 0.305: GRD2.2 37.85,44.7 38.86,43.69 38.86,40.74 R5.1
N$60
  Top 0.305: GRD4.2 48.39,44.7 49.28,43.81 49.28,40.45 R7.1
N$61
  Top 0.305: GRD5.2 51.56,44.7 51.44,44.58 51.31,44.58 50.55,43.81 50.55,41.21 R8.1
N$63
  Top 0.305: 33.36,37.78 C12.+ | T1.B 39.41,37.27 C13.1 R13.2 35.24,37.54 C12.+ | R14.2 33.28,37.35 C12.+
N$64
  Top 0.305: LED1.A 34.42,4.61 R15.2
N$65
  Top 0.305: LED2.A R21.2
N$66
  Top 0.305: LED3.A 39.65,4.67 R22.2
N$67
  Top 0.305: LED4.A R24.2
N$68
  Top 0.305: LED5.A 8.66,35.02 R33.2
N$69
  Top 0.305: LED6.A 11.18,35.29 R34.2
N$70
  Top 0.305: LED7.A 13.69,35.65 R35.2
N$71
  Top 0.305: LED8.A R36.2
N$72
  Top 0.305: R16.1 41.65,36.13 T1.C
N$73
  Top 0.305: T2.B 47.11,37.35 46.61,37.85 45.38,37.85 R17.1 R16.2
N$74
  Top 0.254: USB.2 47.1,13.19 46.35,12.45 R18.1
N$75
  Top 0.254: USB.3 48.64,13.84 48.27,14.21 R20.1 45.36,14.21 R19.1
N$80
  Top 0.305: LED9.A 18.62,35.65 R37.2
N$81
  Top 0.305: LED10.A 21.11,35.65 R38.2
N$82
  Top 0.305: R39.2 22.96,34.81 LED11.A
N$90
  Top 0.254: R26.2 43.75,32.17 SWD.4
N$91
  Top 0.254: R27.2 45.12,29.63 46.35,30.86 46.35,32.18 SWD.5
NRST  (via drill 0.5)
  Top 0.254: R27.1 46.97,28.8 46.97,29.57 v47.62,30.23 | v28.57,20.32 28.19,19.94 24,19.94 23.5,20.45 23.5,21.21 22.3,22.41 U1.7 | RESET.2 39.65,15.34 38.09,13.78 C15.1 36.13,13.78 35.69,14.22 v35.69,15.24 | R43.2 v46.74,10.67
  Bottom 0.254: v47.62,30.23 47.62,30.1 44.2,26.67 44.2,14.86 | v28.57,20.32 33.53,15.24 v35.69,15.24 | 44.2,14.86 40.13,14.86 39.65,15.34 RESET.2 | v46.74,10.67 44.2,13.21 44.2,14.86
SERVO1  (via drill 0.5)
  Top 0.254: v21.72,25.4 22.86,26.54 U1.62
  Bottom 0.254: v21.72,25.4 20.45,25.4 17.78,28.07 11.81,28.07 10.16,29.72 10.16,30.73 6.1,34.8 4.7,34.8 3.17,36.32 2.58,36.32 SL2.1
SERVO2  (via drill 0.5)
  Top 0.254: v21.72,24 23.36,25.64 U1.61
  Bottom 0.254: v21.72,24 20.83,24 17.4,27.43 11.68,27.43 9.53,29.59 9.53,30.35 8.89,30.99 7.75,30.99 4.87,33.87 SL2.2
SW1  (via drill 0.5)
  Top 0.254: v24.26,21.97 26.16,21.97 26.92,22.73 26.92,24.34 27.36,24.77 U1.53
  Bottom 0.254: SW1.1 7.49,9.53 9.65,11.68 18.54,11.68 23.75,16.89 23.75,21.46 v24.26,21.97
SW2  (via drill 0.5)
  Top 0.254: v24.77,20.83 26.16,20.83 27.56,22.23 27.56,24 27.86,24.3 U1.52
  Bottom 0.254: SW1.2 10.03,10.16 10.92,11.05 18.8,11.05 24.38,16.64 24.38,20.45 v24.77,20.83
SWCLK
  Top 0.254: R25.1 38.95,29.37 37.47,30.86 37.47,33.78 36.96,34.29 35.56,34.29 33.15,31.88 33.15,30.1 31.37,28.32 31.37,27.69 31.03,27.34 29.47,27.34 U1.49
SWDIO
  Top 0.254: R26.1 42.04,28.79 42.04,28.07 41.66,27.69 37.34,27.69 35.94,26.29 34.42,26.29 32.52,24.39 31.42,24.39 U1.46
UART_RX
  Top 0.254: UART.2 42.95,25.63 41.53,27.05 39.75,27.05 39.12,26.42 39.12,24.89 38.61,24.38 35.31,24.38 33.82,22.89 31.42,22.89 U1.43
UART_TX
  Top 0.254: UART.1 39.06,23.75 35.56,23.75 34.21,22.39 31.42,22.39 U1.42
USB_DM  (via drill 0.5)
  Top 0.254: v38.1,25.4 37.59,25.02 35.05,25.02 33.43,23.39 31.42,23.39 U1.44 31.39,23.39 29.82,23.39 28.83,24.38 v28.83,25.53 | v30.35,30.61 31.11,31.37 LED14.C | R18.2 42.93,12.45 41.91,13.46 v41.91,16.89
  Bottom 0.254: v28.83,25.53 28.83,27.69 29.46,28.32 29.46,29.34 29.97,29.84 29.97,30.23 v30.35,30.61 | v38.1,25.4 38.1,23.75 41.91,19.94 v41.91,16.89
USB_DP  (via drill 0.5)
  Top 0.254: v37.72,26.67 36.7,25.65 34.8,25.65 33.04,23.89 31.42,23.89 U1.45 31.39,23.89 30.33,23.89 29.84,24.38 29.84,25.78 v30.61,26.42 | LED13.C 28.63,31.95 29.34,31.24 29.34,29.84 29.97,29.21 29.97,28.83 v30.48,28.32 | R19.2 43.91,15.28 v43.18,16
  Bottom 0.254: v30.61,26.42 30.61,28.19 v30.48,28.32 | v37.72,26.67 38.35,26.67 39.12,25.91 39.12,23.88 43.18,19.81 v43.18,16
USB_ON  (via drill 0.5)
  Top 0.254: LED12.C 27.3,30.9 27.3,30.1 26.85,29.65 26.86,29.64 U1.54 26.86,25.71 26.85,25.71 v26.42,25.4 | 49.4,20.1 R30.1 49.28,20.11 v49.28,18.41
  Bottom 0.254: v26.42,25.4 27.56,24.26 27.56,19.94 32.51,14.99 32.51,8.38 33.78,7.11 46.1,7.11 49.28,10.29 v49.28,18.41

### Text on the board
tPlace: 1 | 1 | 1 | 1 | www.sims.pl | sumo_base_5